# EAGLE design display_test (EAGLE 8.1.1)
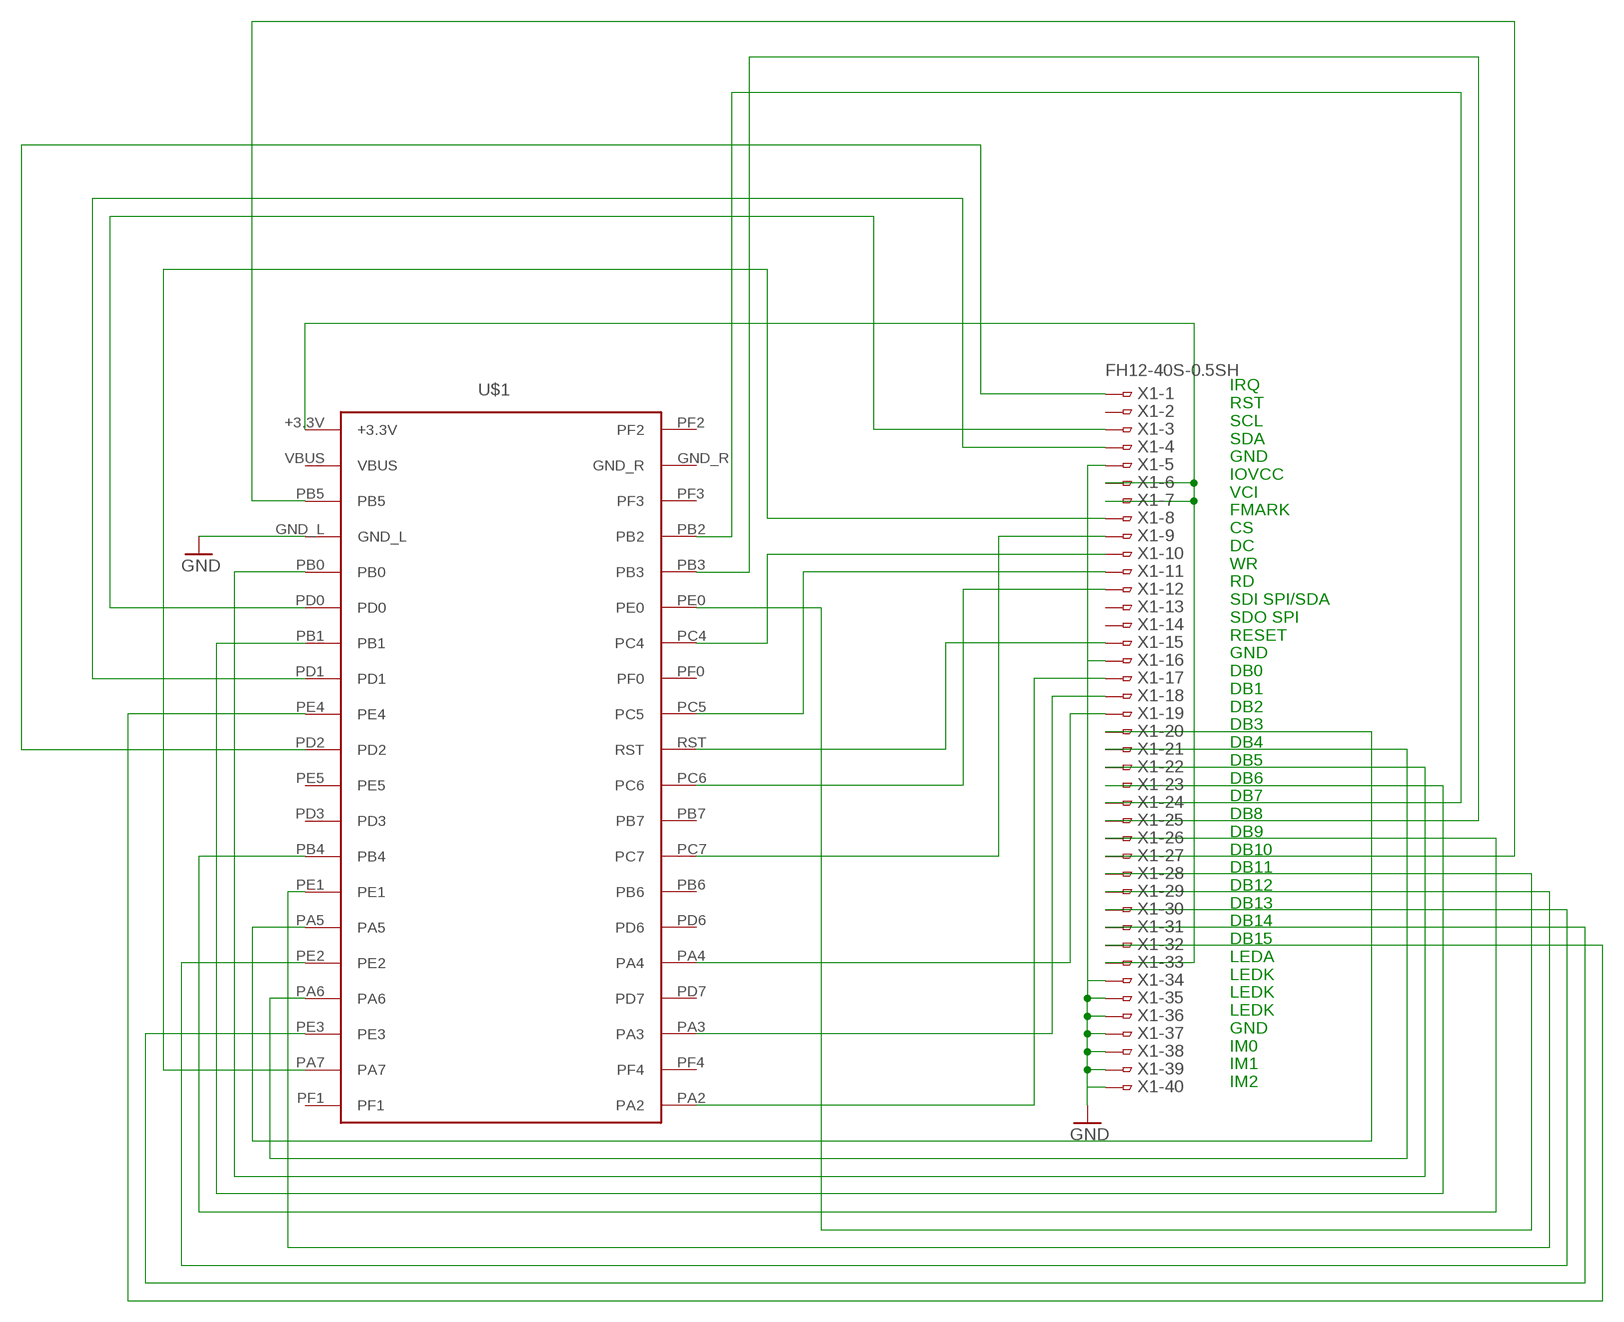
[diagram p0: schematic, sheet 1]

## Parts
U$1  TM4CTM4C  [1_05X2MM]
X1  FH12-40S-0.5SH  [FH12-40S-0.5SH]

## Nets
GND: U$1.GND_L X1.5 X1.16 X1.34 X1.35 X1.36 X1.37 X1.38 X1.39 X1.40
N$1: U$1.+3.3V X1.6 X1.7 X1.33
N$2: U$1.RST X1.15
N$3: U$1.PC4 X1.10
N$5: U$1.PC5 X1.11
N$6: U$1.PC6 X1.12
N$7: U$1.PC7 X1.9
N$8: U$1.PA2 X1.17
N$9: U$1.PA7 X1.8
N$10: U$1.PD0 X1.3
N$11: U$1.PD1 X1.4
N$12: U$1.PD2 X1.1
N$13: U$1.PA3 X1.18
N$14: U$1.PA4 X1.19
N$15: U$1.PA5 X1.20
N$16: U$1.PA6 X1.21
N$17: U$1.PB0 X1.22
N$18: U$1.PB1 X1.23
N$19: U$1.PB2 X1.24
N$20: U$1.PB3 X1.25
N$21: U$1.PB4 X1.26
N$22: U$1.PB5 X1.27
N$23: U$1.PE0 X1.28
N$24: U$1.PE1 X1.29
N$25: U$1.PE2 X1.30
N$26: U$1.PE3 X1.31
N$27: U$1.PE4 X1.32
Unconnected: U$1.PB6 U$1.PB7 U$1.PD3 U$1.PD6 U$1.PD7 U$1.PE5 U$1.PF0 U$1.PF1 U$1.PF2 U$1.PF3 U$1.PF4 X1.2 X1.13 X1.14

## Notes on the sheet
- IRQ
  RST
  SCL
  SDA
  GND
  IOVCC
  VCI
  FMARK
  CS
  DC
  WR
  RD
  SDI SPI/SDA
  SDO SPI
  RESET
  GND
  DB0
  DB1
  DB2
  DB3
  DB4
  DB5
  DB6
  DB7
  DB8
  DB9
  DB10
  DB11
  DB12
  DB13
  DB14
  DB15
  LEDA
  LEDK
  LEDK
  LEDK
  GND
  IM0
  IM1
  IM2

## Power pins joined to a net without a drawn wire
GND_R: U$1.GND_R
VBUS: U$1.VBUS

## Library data of the parts
U$1 = TM4C:TM4C: Tiva TM4C Lauchpad. Untested.
X1 = con-hirose:FH12-40S-0.5S: 0.5mm Pitch Connectors For FPC/FFC Source: Data sheet <http://www.hirose.co.jp/cataloge_hp/e58605370.pdf>; MPN: FH12-40S-0.5SH(55); OC_FARNELL: 1324556; OC_NEWARK: 34M6178

## Board
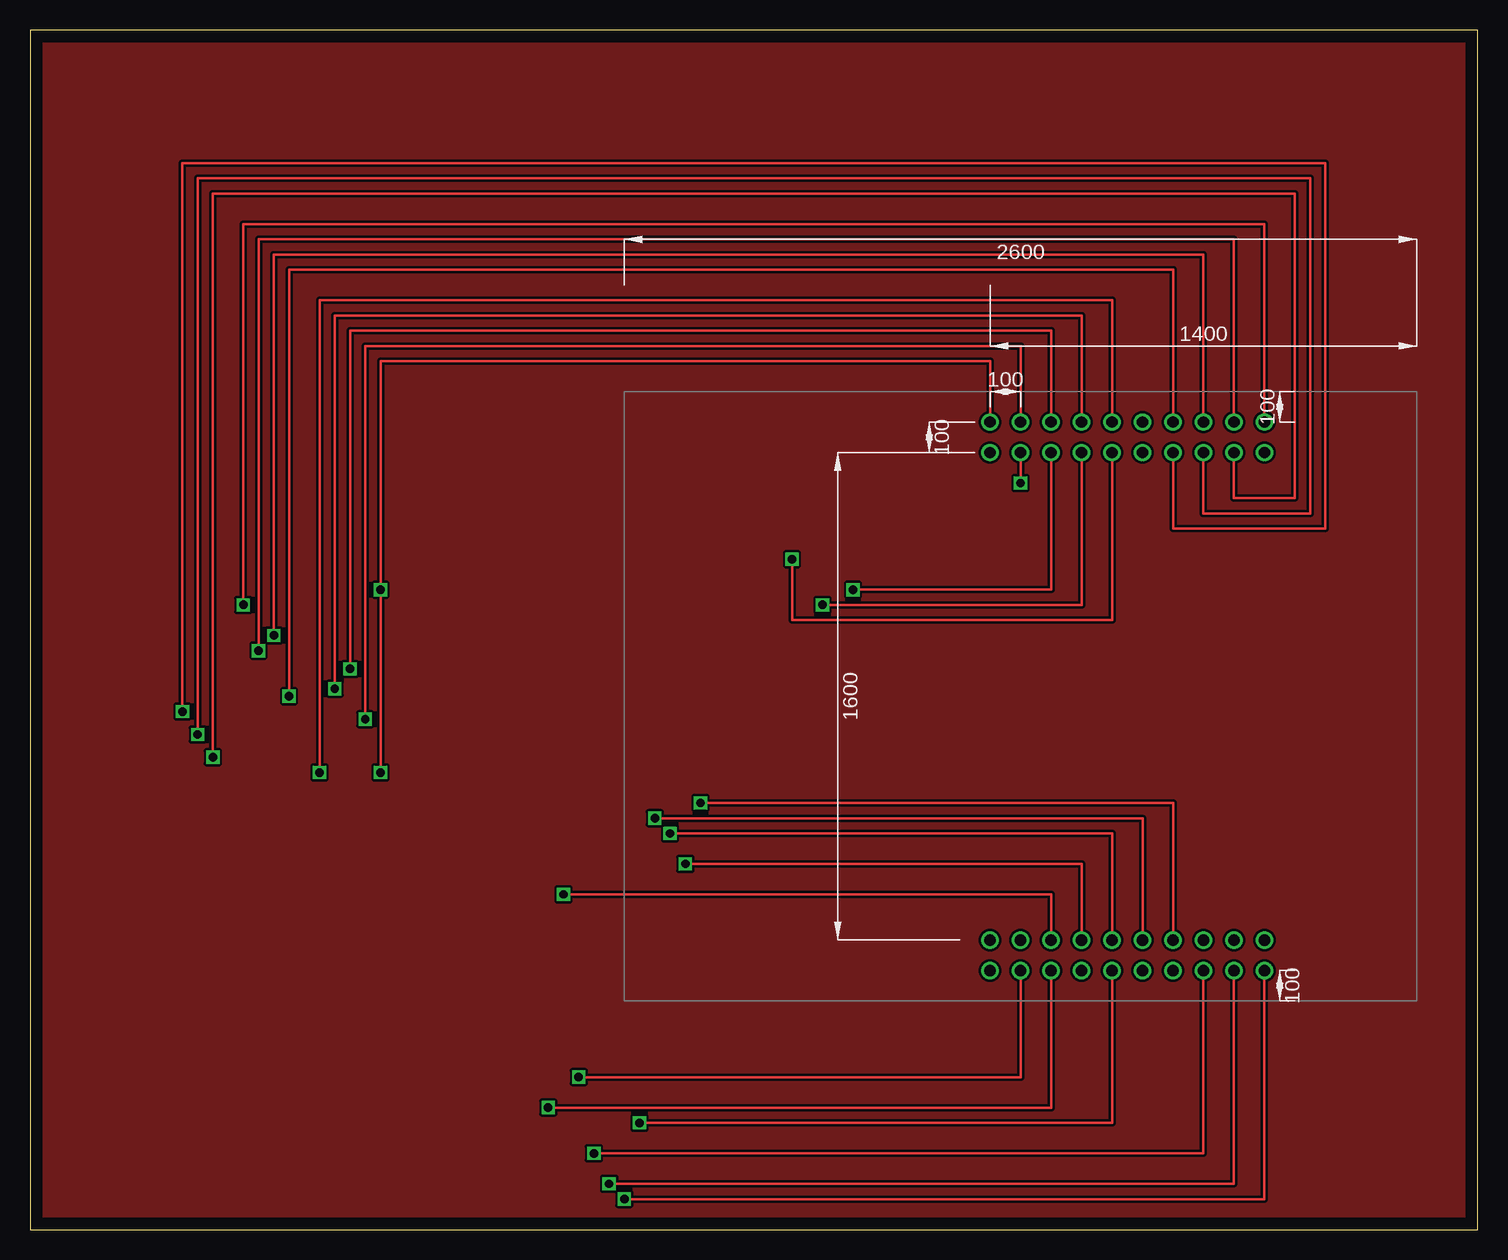
[diagram p1: board, top side]
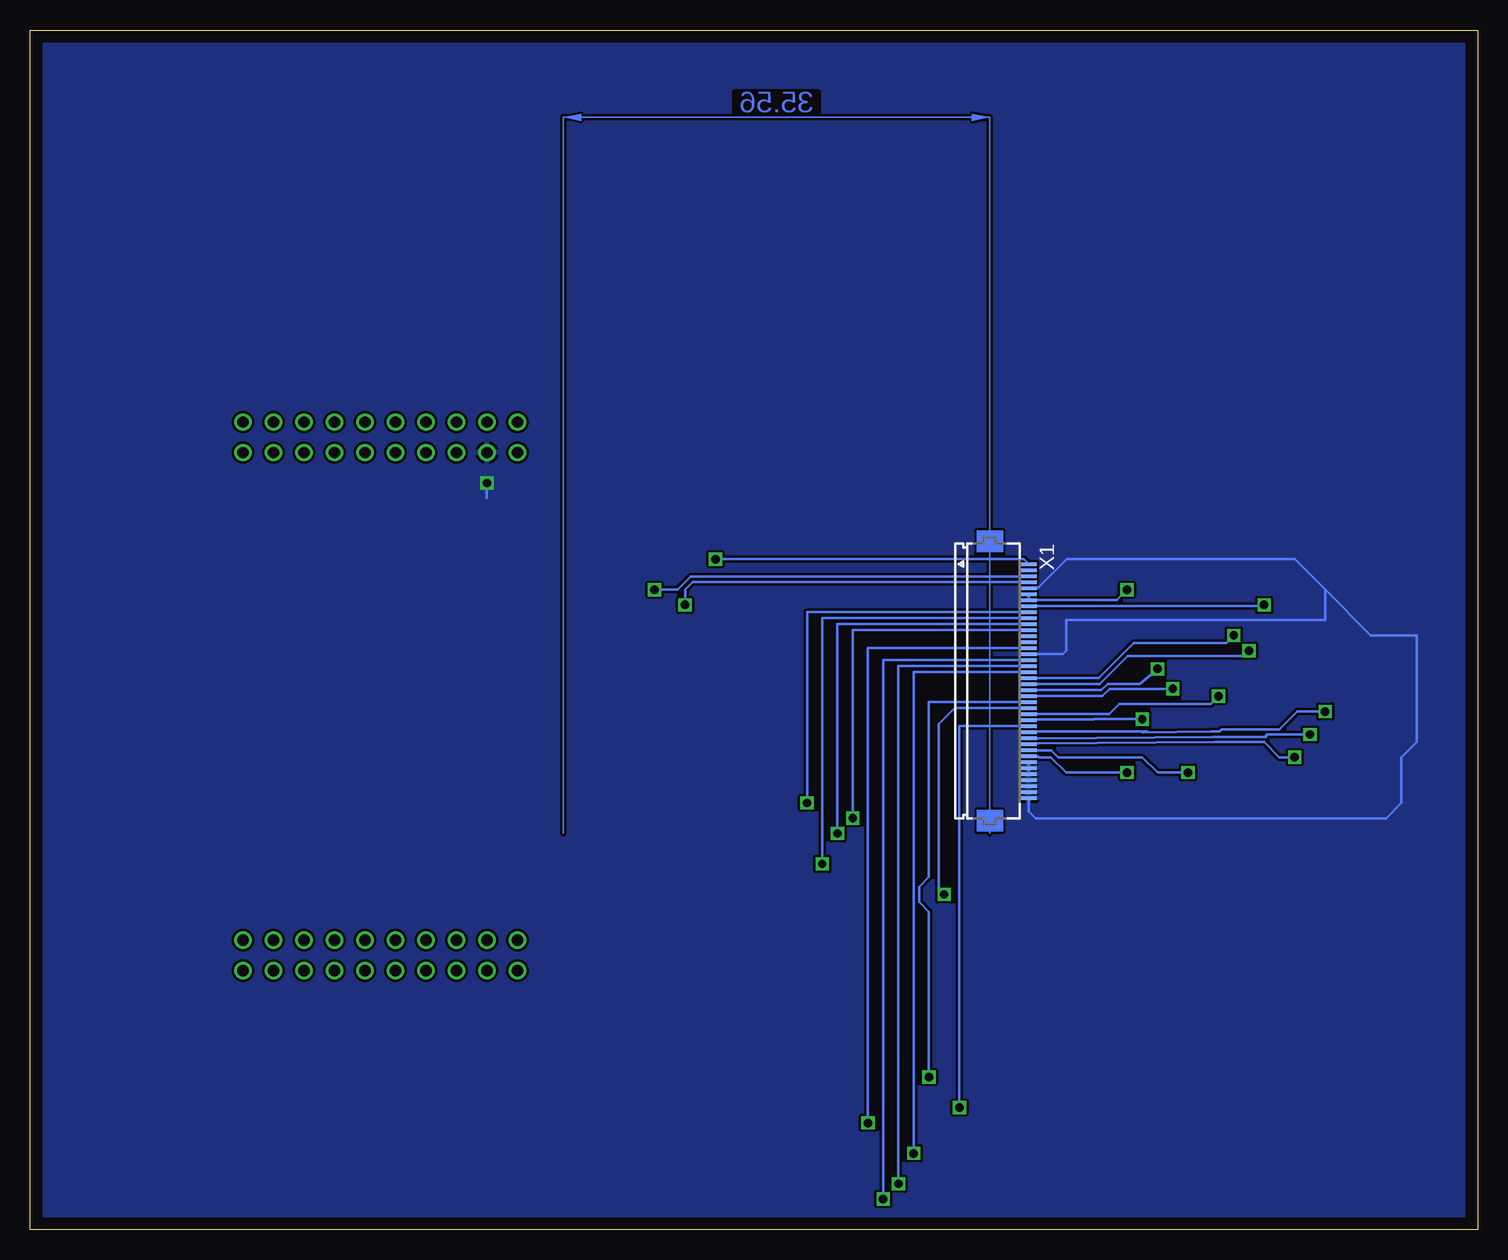
[diagram p2: board, bottom side, seen from below]

Size 120.63 x 100 mm. Coordinates in mm from the lower left corner, seen from the top.
Outline: 0,0 120.63,0 120.63,100 0,100 0,0
Copper layers (1*16): Top 0.035mm / dielectric 1.5mm / Bottom 0.035mm
Design rules "default": minimum track width 10mil, minimum drill 24mil, track to track 8mil, track to pad 8mil, pad to pad 8mil, via to via 8mil, smd to smd 8mil, copper to edge 40mil, drill to drill 8mil, minimum pad ring 10mil, minimum via ring 8mil, stop-mask expansion 4mil, vias tented up to drill 0mil, thermal gap 10mil

### Footprints (pad centres in the part's own frame; a part is rotated, then mirrored left to right if it is on the bottom)
1_05X2MM = drill 0.94: +3.3V -7.62,8.89; GND_L -10.16,6.35; GND_R -53.34,8.89; PA2 -53.34,-13.97; PA3 -53.34,-11.43; PA4 -53.34,-8.89; PA5 -7.62,-8.89; PA6 -7.62,-11.43; PA7 -7.62,-13.97; PB0 -7.62,3.81; PB1 -7.62,1.27; PB2 -53.34,6.35; PB3 -50.8,3.81; PB4 -7.62,-6.35; PB5 -7.62,6.35; PB6 -53.34,-6.35; PB7 -53.34,-3.81; PC4 -50.8,1.27; PC5 -50.8,-1.27; PC6 -50.8,-3.81; PC7 -50.8,-6.35; PD0 -10.16,3.81; PD1 -10.16,1.27; PD2 -10.16,-1.27; PD3 -10.16,-3.81; PD6 -50.8,-8.89; PD7 -50.8,-11.43; PE0 -53.34,3.81; PE1 -10.16,-6.35; PE2 -10.16,-8.89; PE3 -10.16,-11.43; PE4 -7.62,-1.27; PE5 -7.62,-3.81; PF0 -53.34,1.27; PF1 -10.16,-13.97; PF2 -50.8,8.89; PF3 -50.8,6.35; PF4 -50.8,-13.97; RST -53.34,-1.27; VBUS -10.16,8.89
FH12-40S-0.5SH = smd 0.3 x 1.3: 1 -9.75,3.25; 2 -9.25,3.25; 3 -8.75,3.25; 4 -8.25,3.25; 5 -7.75,3.25; 6 -7.25,3.25; 7 -6.75,3.25; 8 -6.25,3.25; 9 -5.75,3.25; 10 -5.25,3.25; 11 -4.75,3.25; 12 -4.25,3.25; 13 -3.75,3.25; 14 -3.25,3.25; 15 -2.75,3.25; 16 -2.25,3.25; 17 -1.75,3.25; 18 -1.25,3.25; 19 -0.75,3.25; 20 -0.25,3.25; 21 0.25,3.25; 22 0.75,3.25; 23 1.25,3.25; 24 1.75,3.25; 25 2.25,3.25; 26 2.75,3.25; 27 3.25,3.25; 28 3.75,3.25; 29 4.25,3.25; 30 4.75,3.25; 31 5.25,3.25; 32 5.75,3.25; 33 6.25,3.25; 34 6.75,3.25; 35 7.25,3.25; 36 7.75,3.25; 37 8.25,3.25; 38 8.75,3.25; 39 9.25,3.25; 40 9.75,3.25

### Placement (x,y rotation side)
U$1  88.9,74.93 90 top
X1  40.64,45.72 270 bottom

### Tracks (layer width: path | path; a pad name or v marks a point on that pad's centre or on a via)
GND  (via drill 0.7)
  Top 0.229: U$1.GND_L v82.55,62.23
  Bottom 0.229: X1.5 37.36,53.5 36.61,53.5 34.23,55.88 15.24,55.88 12.7,53.34 | 12.7,53.34 8.89,49.53 5.08,49.53 5.08,40.64 6.35,39.37 6.35,35.56 7.62,34.29 36.83,34.29 37.39,34.85 X1.40 | 12.7,53.34 12.7,50.8 34.29,50.8 34.29,48.26 34.58,47.97 X1.16 | v82.55,62.23 82.55,60.96 | X1.34 X1.36
  pour Bottom: 120.65,0 0,0 0,100.33 120.65,100.33
N$1  (via drill 0.7)
  Top 0.229: U$1.+3.3V 80.01,72.39 29.21,72.39 v29.21,53.34 v29.21,38.1
  Bottom 0.229: X1.6 X1.7 30.08,52.47 v29.21,53.34 | X1.33 37.36,39.44 36.61,39.44 36.54,39.37 35.56,39.37 34.29,38.1 v29.21,38.1
N$2  (via drill 0.7)
  Top 0.229: v50.8,8.89 90.17,8.89 U$1.RST
  Bottom 0.229: X1.15 50.8,48.47 v50.8,8.89
N$3  (via drill 0.7)
  Top 0.229: v54.61,30.48 87.63,30.48 U$1.PC4
  Bottom 0.229: X1.10 54.61,50.97 v54.61,30.48
N$4
  pour Top: 0,100.33 120.65,100.33 120.65,0 0,0
N$5  (via drill 0.7)
  Top 0.229: v53.34,33.02 90.17,33.02 U$1.PC5
  Bottom 0.229: X1.11 53.34,50.47 v53.34,33.02
N$6  (via drill 0.7)
  Top 0.229: v52.07,34.29 92.71,34.29 U$1.PC6
  Bottom 0.229: X1.12 52.07,49.97 v52.07,34.29
N$7  (via drill 0.7)
  Top 0.229: v55.88,35.56 95.25,35.56 U$1.PC7
  Bottom 0.229: X1.9 55.88,51.47 v55.88,35.56
N$8  (via drill 0.7)
  Top 0.229: v49.53,2.54 102.87,2.54 U$1.PA2
  Bottom 0.229: X1.17 49.53,47.47 v49.53,2.54
N$9  (via drill 0.7)
  Top 0.229: v17.78,52.07 17.78,83.82 102.87,83.82 U$1.PA7
  Bottom 0.229: X1.8 17.78,51.97 v17.78,52.07
N$10  (via drill 0.7)
  Top 0.229: v68.58,53.34 85.09,53.34 U$1.PD0
  Bottom 0.229: X1.3 37.42,54.44 65.55,54.44 66.65,53.34 v68.58,53.34
N$11  (via drill 0.7)
  Top 0.229: v66.04,52.07 87.63,52.07 U$1.PD1
  Bottom 0.229: X1.4 65.41,53.98 66.04,53.34 v66.04,52.07
N$12  (via drill 0.7)
  Top 0.229: v63.5,55.88 63.5,50.8 90.17,50.8 U$1.PD2
  Bottom 0.229: X1.1 37.8,55.88 v63.5,55.88
N$13  (via drill 0.7)
  Top 0.229: v48.26,3.81 100.33,3.81 U$1.PA3
  Bottom 0.229: X1.18 48.26,46.97 v48.26,3.81
N$14  (via drill 0.7)
  Top 0.229: v46.99,6.35 97.79,6.35 U$1.PA4
  Bottom 0.229: X1.19 46.99,46.47 v46.99,6.35
N$15  (via drill 0.7)
  Top 0.229: v20.32,49.53 20.32,81.28 97.79,81.28 U$1.PA5
  Bottom 0.229: X1.20 31.59,45.97 28.66,48.9 20.95,48.9 v20.32,49.53
N$16  (via drill 0.7)
  Top 0.229: v19.05,48.26 19.05,82.55 100.33,82.55 U$1.PA6
  Bottom 0.229: X1.21 31.48,45.47 29.14,47.81 19.5,47.81 v19.05,48.26
N$17  (via drill 0.7)
  Top 0.229: v26.67,46.74 26.67,74.93 85.09,74.93 U$1.PB0
  Bottom 0.229: X1.22 31.37,44.97 30.84,45.5 28.16,45.5 v26.67,46.74
N$18  (via drill 0.7)
  Top 0.229: v25.4,45.09 25.4,76.2 87.63,76.2 U$1.PB1
  Bottom 0.229: X1.23 31.26,44.47 30.66,45.07 26.05,45.07 v25.4,45.09
N$19  (via drill 0.7)
  Top 0.229: v45.72,12.7 82.55,12.7 U$1.PB2
  Bottom 0.229: X1.24 45.72,43.97 45.72,29.39 46.54,28.57 46.54,27.3 45.72,26.48 v45.72,12.7
N$20  (via drill 0.7)
  Top 0.229: v44.45,27.94 85.09,27.94 U$1.PB3
  Bottom 0.229: X1.25 43.56,43.47 44.88,42.15 44.88,27.94 v44.45,27.94
N$21  (via drill 0.7)
  Top 0.229: v21.59,44.45 21.59,80.01 95.25,80.01 U$1.PB4
  Bottom 0.229: v21.59,44.45 22.23,43.81 29.84,43.81 30.68,42.98 32.14,42.98 32.15,42.97 X1.26
N$22  (via drill 0.7)
  Top 0.229: U$1.PB5 82.55,73.66 27.94,73.66 v27.94,42.55
  Bottom 0.229: v27.94,42.55 31.96,42.55 32,42.5 37.36,42.5 X1.27
N$23  (via drill 0.7)
  Top 0.229: v43.18,10.16 85.09,10.16 U$1.PE0
  Bottom 0.229: X1.28 43.18,41.97 v43.18,10.16
N$24  (via drill 0.7)
  Top 0.229: v12.7,43.18 12.7,88.9 107.95,88.9 107.95,58.42 95.25,58.42 U$1.PE1
  Bottom 0.229: X1.29 37.36,41.5 27.94,41.5 | 27.94,41.5 27.53,41.5 | 27.94,41.5 27.89,41.45 22.22,41.5 22.05,41.5 21.87,41.51 21.87,41.5 21.77,41.51 21.52,41.51 21.32,41.71 16.51,41.71 15.04,43.18 v12.7,43.18
N$25  (via drill 0.7)
  Top 0.229: v13.97,41.27 13.97,87.63 106.68,87.63 106.68,59.69 97.79,59.69 U$1.PE2
  Bottom 0.229: X1.30 37.36,40.94 36.61,40.94 22.05,41.07 21.87,41.07 21.69,41.07 17.78,41.07 | 17.78,41.07 17.6,41.07 | 17.78,41.07 17.58,41.27 v13.97,41.27
N$26  (via drill 0.7)
  Top 0.229: v15.24,39.37 15.24,86.36 105.41,86.36 105.41,60.96 100.33,60.96 U$1.PE3
  Bottom 0.229: X1.31 37.36,40.5 36.61,40.5 21.87,40.64 17.78,40.64 16.51,39.37 v15.24,39.37
N$27  (via drill 0.7)
  Top 0.229: v24.13,38.1 24.13,77.47 90.17,77.47 U$1.PE4
  Bottom 0.229: 37.36,39.94 X1.32 37.36,39.94 | 37.36,39.94 35.52,39.94 34.95,39.37 27.94,39.37 26.67,38.1 v24.13,38.1
(copper drawn outside any net)
  shapes: Bottom area x1